# EAGLE design lia_2-0 (EAGLE 6.5.0)

## Sheet 1 of 3
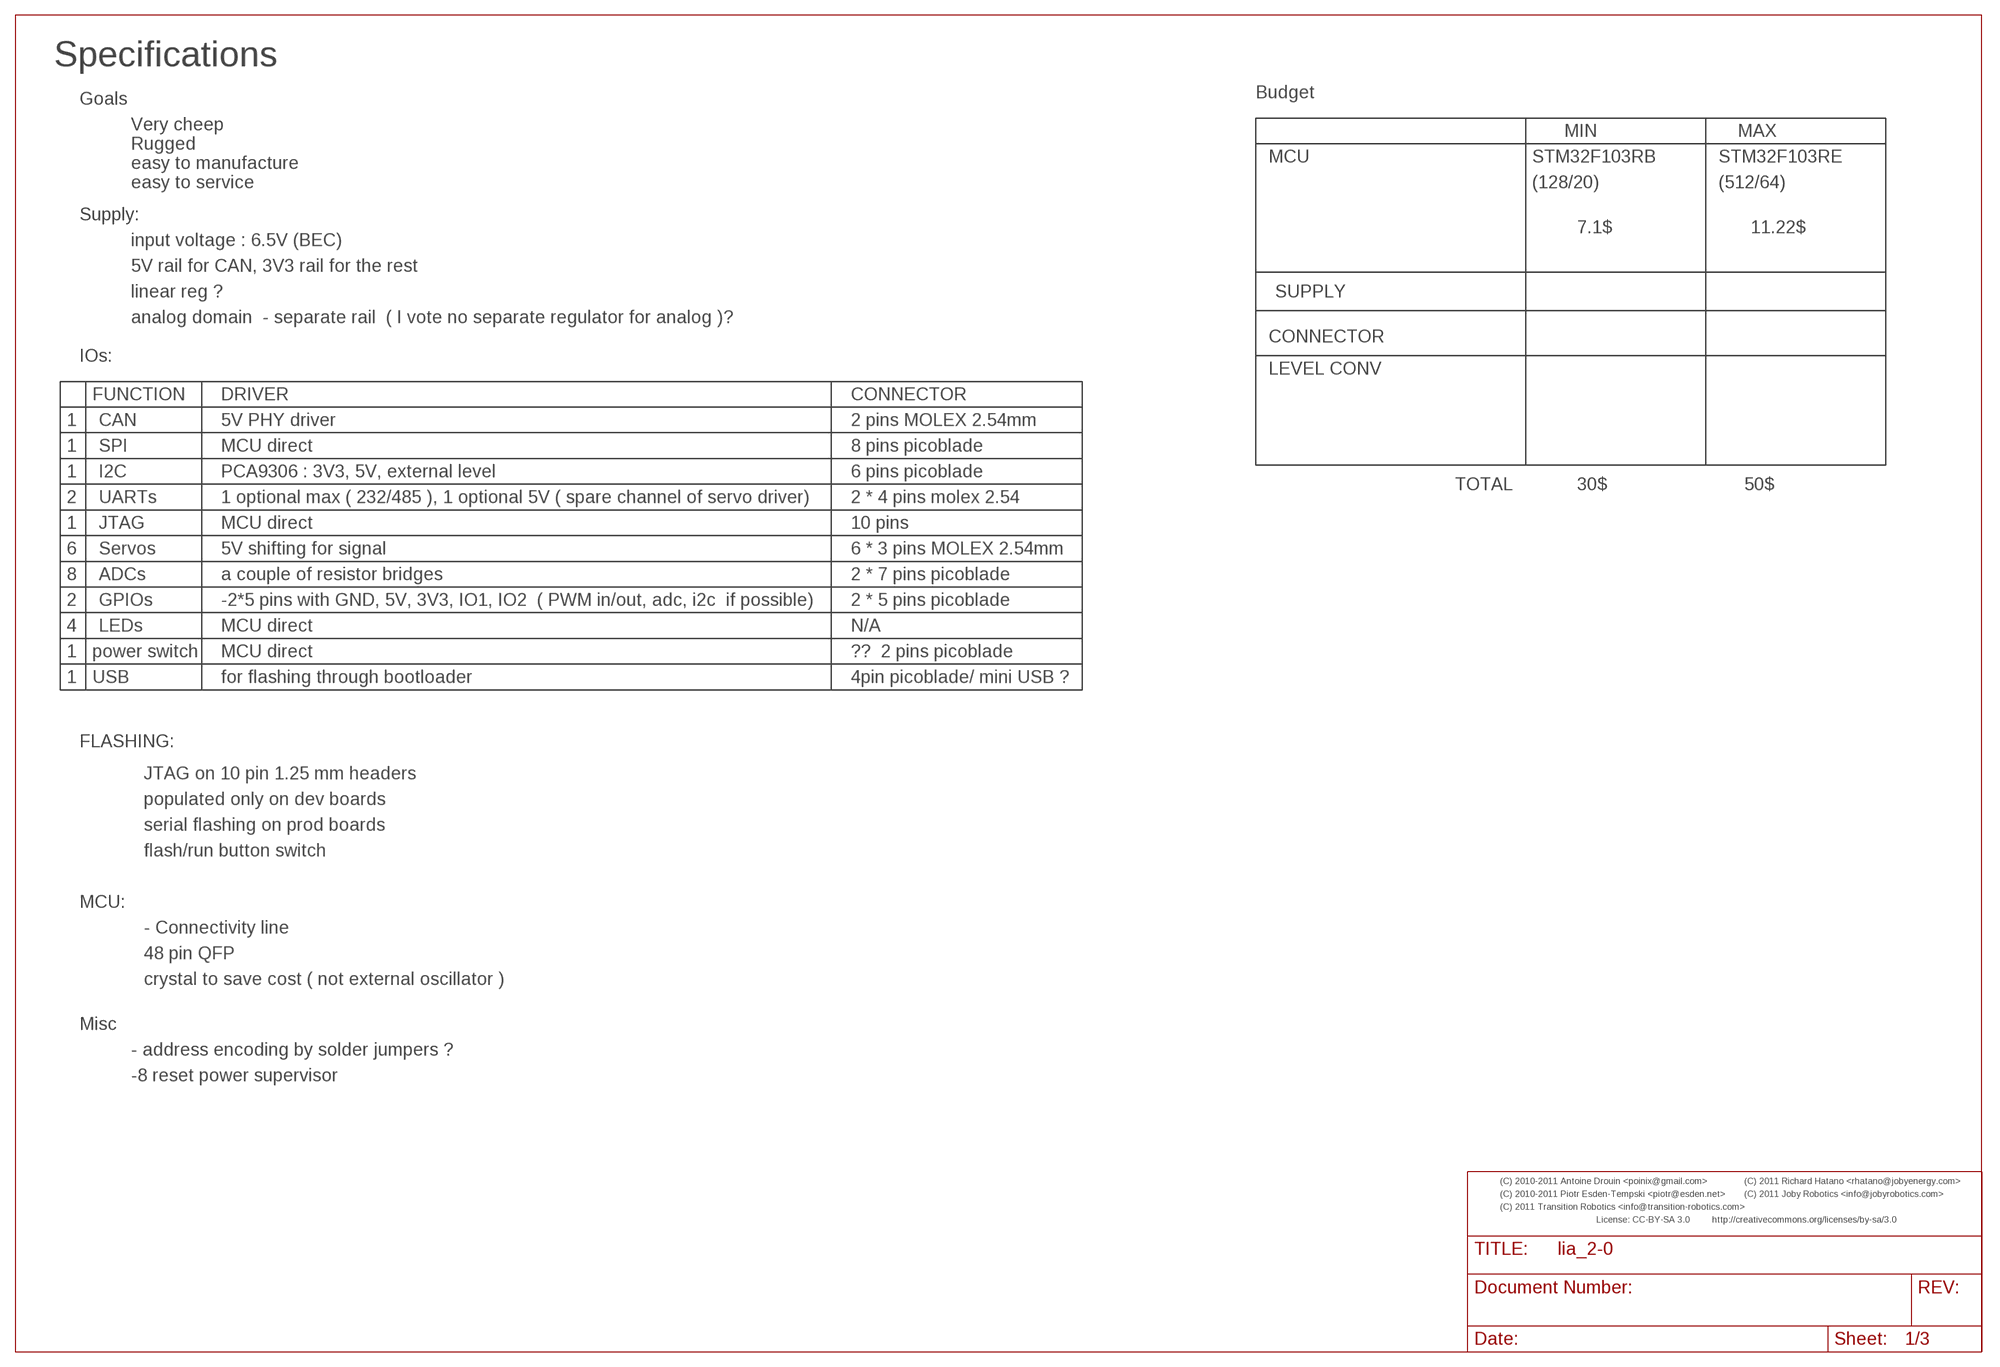
[diagram p0: schematic, sheet 1]

### Notes on the sheet
- Specifications
- Budget
- Goals
- Very cheep
- MIN | MAX
- Rugged
- MCU | STM32F103RB | STM32F103RE
- easy to manufacture
- easy to service | (128/20) | (512/64)
- Supply:
- 7.1$ | 11.22$
- input voltage : 6.5V (BEC)
- 5V rail for CAN, 3V3 rail for the rest
- linear reg ? | SUPPLY
- analog domain  - separate rail  ( I vote no separate regulator for analog )?
- CONNECTOR
- IOs:
- LEVEL CONV
- FUNCTION | DRIVER | CONNECTOR
- 1 | CAN | 5V PHY driver | 2 pins MOLEX 2.54mm
- 1 | SPI | MCU direct | 8 pins picoblade
- 1 | I2C | PCA9306 : 3V3, 5V, external level | 6 pins picoblade
- TOTAL | 30$ | 50$
- 2 | UARTs | 1 optional max ( 232/485 ), 1 optional 5V ( spare channel of servo driver) | 2 * 4 pins molex 2.54
- 1 | JTAG | MCU direct | 10 pins
- 6 | Servos | 5V shifting for signal | 6 * 3 pins MOLEX 2.54mm
- 8 | ADCs | a couple of resistor bridges | 2 * 7 pins picoblade
- 2 | GPIOs | -2*5 pins with GND, 5V, 3V3, IO1, IO2  ( PWM in/out, adc, i2c  if possible) | 2 * 5 pins picoblade
- 4 | LEDs | MCU direct | N/A
- 1 | power switch | MCU direct | ??  2 pins picoblade
- 1 | USB | for flashing through bootloader | 4pin picoblade/ mini USB ?
- FLASHING:
- JTAG on 10 pin 1.25 mm headers
- populated only on dev boards
- serial flashing on prod boards
- flash/run button switch
- MCU:
- - Connectivity line
- 48 pin QFP
- crystal to save cost ( not external oscillator )
- Misc
- - address encoding by solder jumpers ?
- -8 reset power supervisor
- (C) 2010-2011 Antoine Drouin <poinix@gmail.com> | (C) 2011 Richard Hatano <rhatano@jobyenergy.com>
- (C) 2010-2011 Piotr Esden-Tempski <piotr@esden.net> | (C) 2011 Joby Robotics <info@jobyrobotics.com>
- (C) 2011 Transition Robotics <info@transition-robotics.com>
- License: CC-BY-SA 3.0 | http://creativecommons.org/licenses/by-sa/3.0

## Sheet 2 of 3
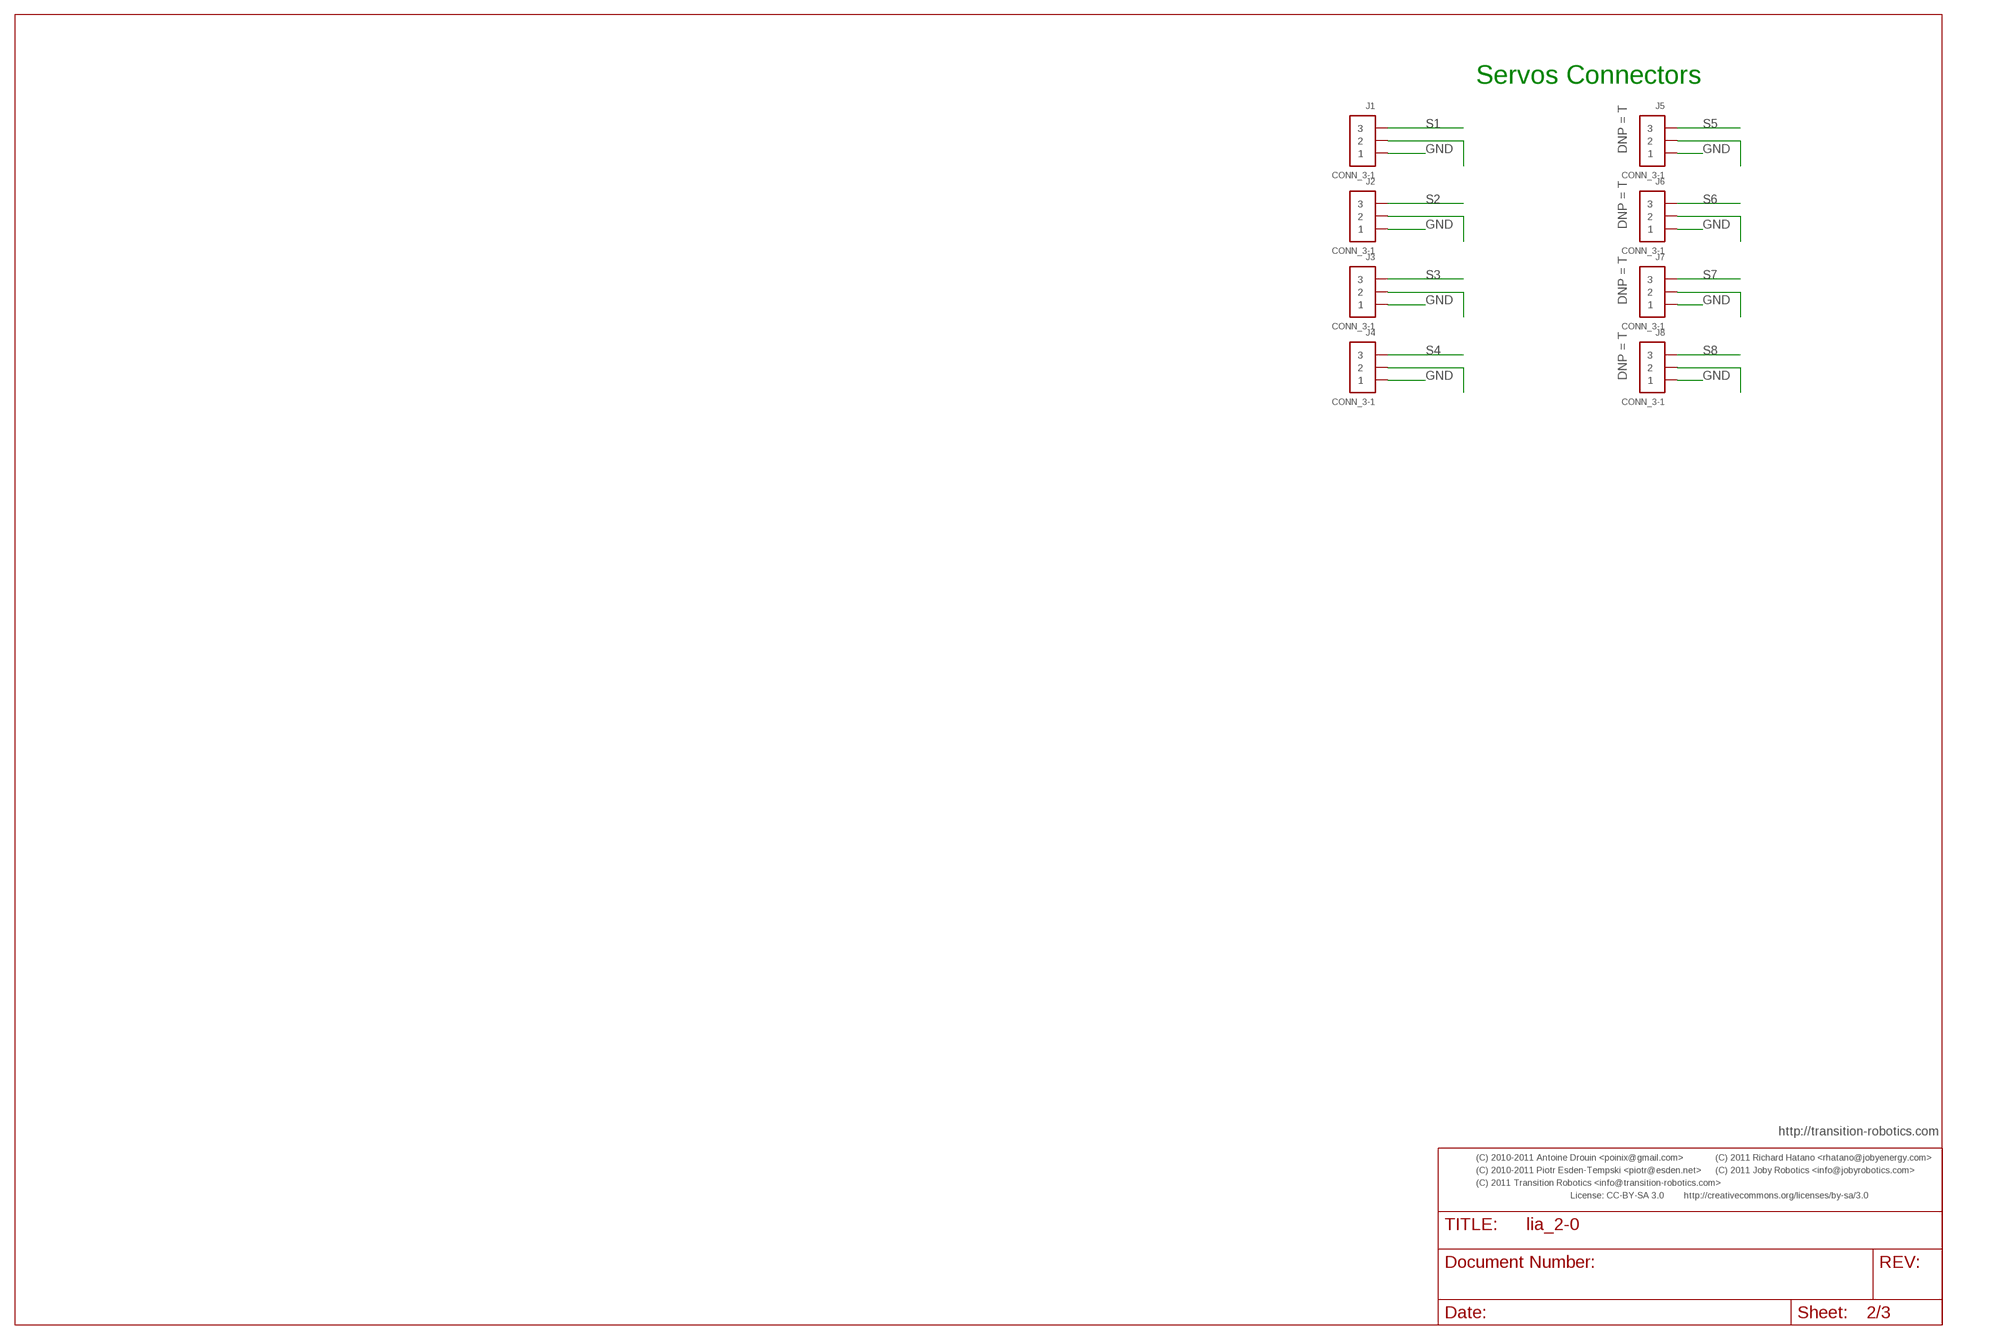
[diagram p1: schematic, sheet 2]

### Parts
J1  CONN_3-1  [SIP1X3_100]
J2  CONN_3-1  [SIP1X3_100]
J3  CONN_3-1  [SIP1X3_100]
J4  CONN_3-1  [SIP1X3_100]
J5  CONN_3-1  [SIP1X3_100]
J6  CONN_3-1  [SIP1X3_100]
J7  CONN_3-1  [SIP1X3_100]
J8  CONN_3-1  [SIP1X3_100]

### Nets
GND: J1.1 J2.1 J3.1 J4.1 J5.1 J6.1 J7.1 J8.1 ; also sheet 3
N$2: J5.2
N$3: J6.2
N$16: J7.2
N$17: J8.2
N$18: J4.2
N$19: J3.2
N$20: J2.2
N$21: J1.2
S1: J1.3
S2: J2.3
S3: J3.3
S4: J4.3
S5: J5.3
S6: J6.3
S7: J7.3
S8: J8.3

### Notes on the sheet
- Servos Connectors
- http://transition-robotics.com
- (C) 2010-2011 Antoine Drouin <poinix@gmail.com> | (C) 2011 Richard Hatano <rhatano@jobyenergy.com>
- (C) 2010-2011 Piotr Esden-Tempski <piotr@esden.net> | (C) 2011 Joby Robotics <info@jobyrobotics.com>
- (C) 2011 Transition Robotics <info@transition-robotics.com>
- License: CC-BY-SA 3.0 | http://creativecommons.org/licenses/by-sa/3.0

## Sheet 3 of 3
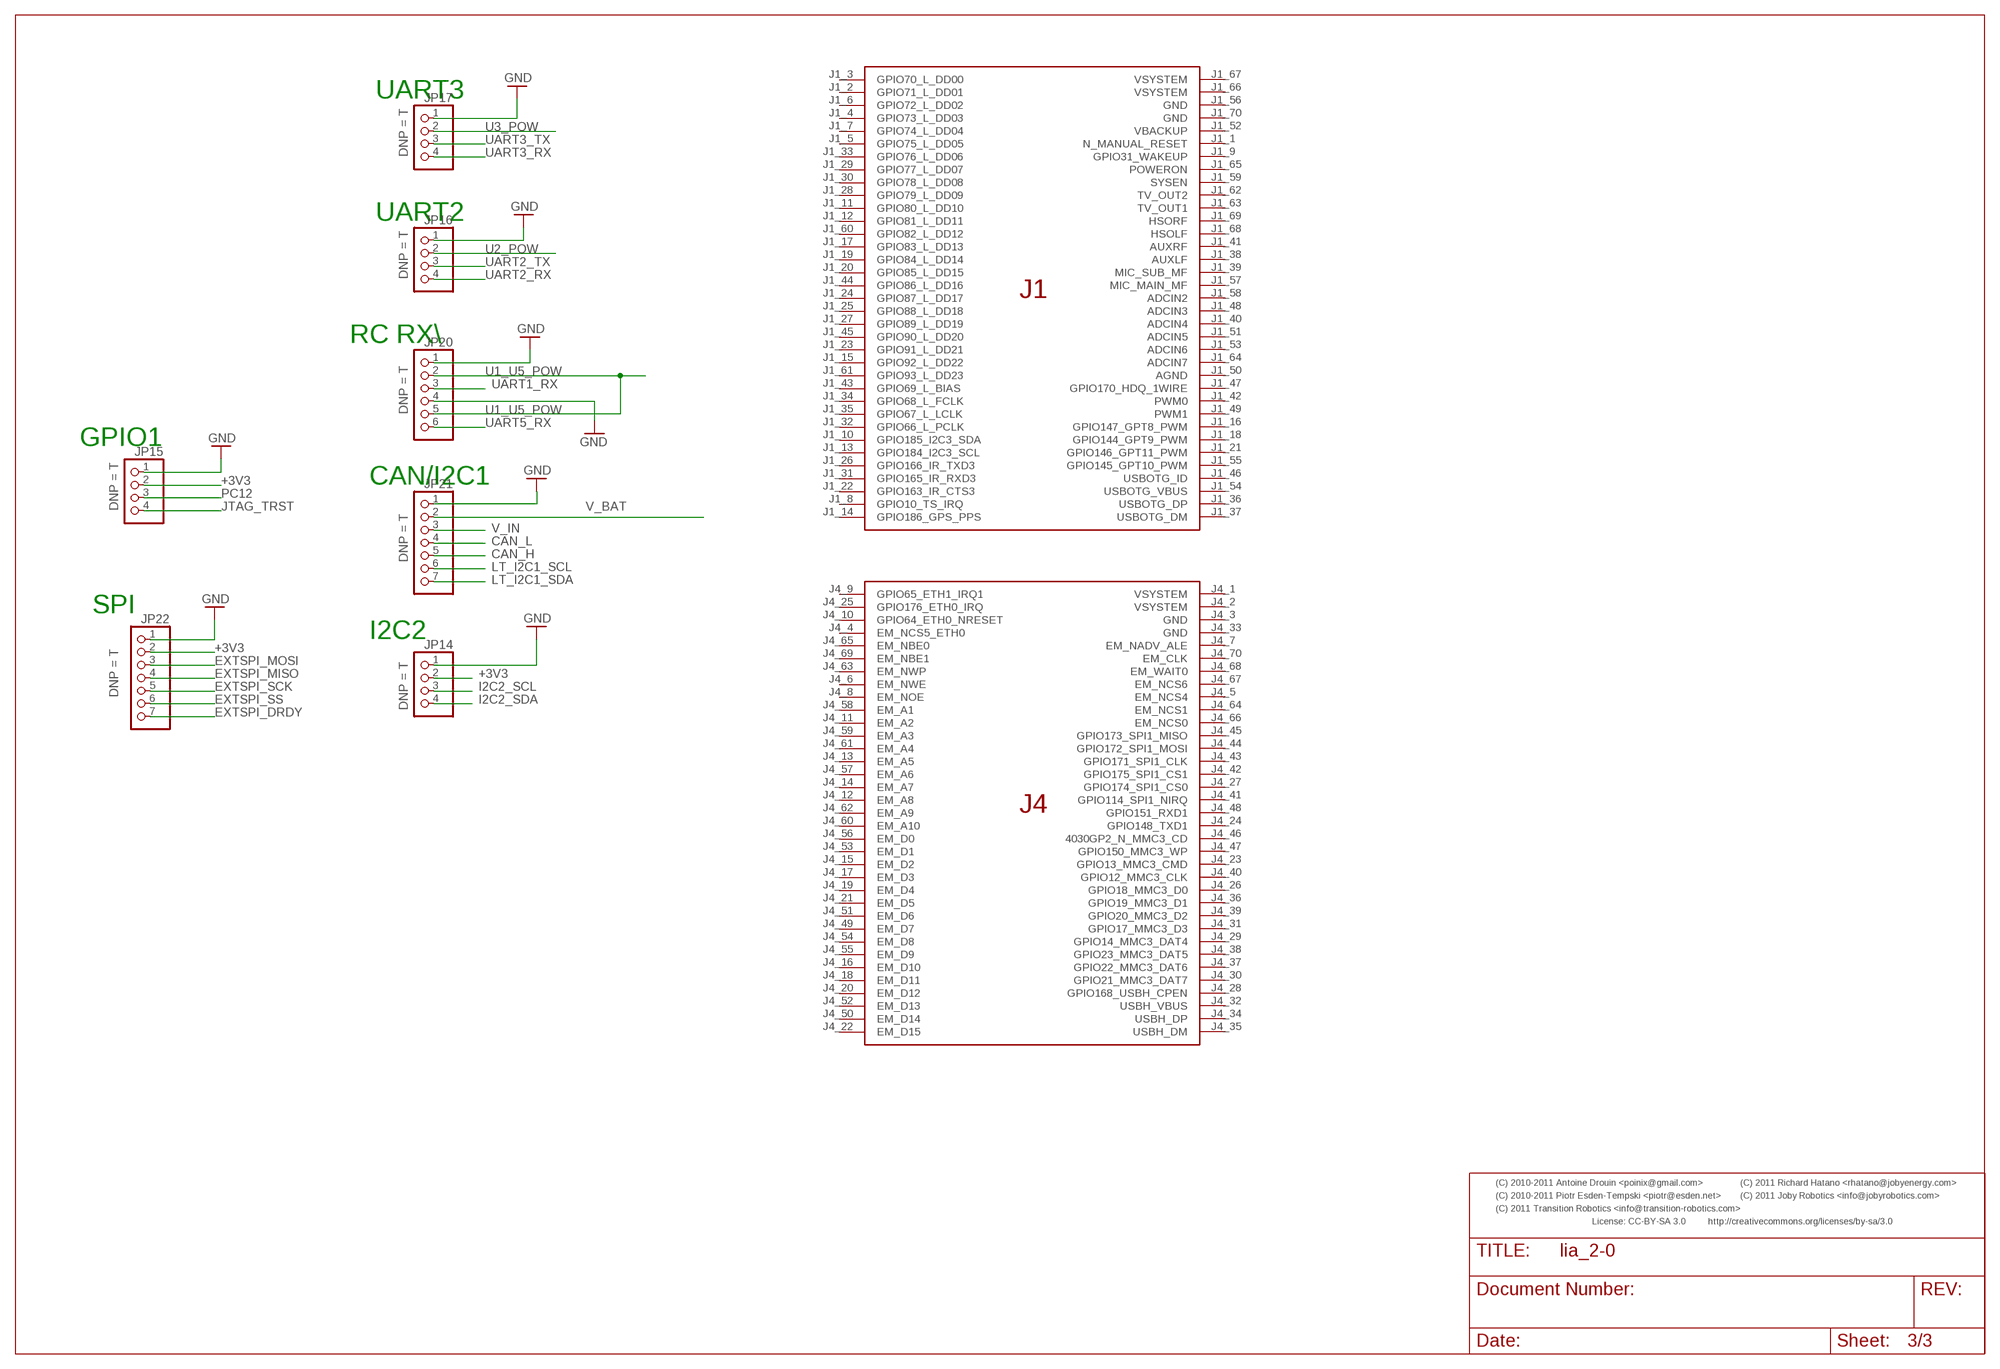
[diagram p2: schematic, sheet 3]

### Parts
JP14  PINHD-1X4  [1X04]
JP15  PINHD-1X4  [1X04]
JP16  PINHD-1X4  [1X04]
JP17  PINHD-1X4  [1X04]
JP20  PINHD-1X6  [1X06]
JP21  PINHD-1X7  [1X07]
JP22  PINHD-1X7  [1X07]
U$2  OVERO  [OVERO]

### Nets
+3V3: JP14.2 JP15.2 JP22.2
CAN_H: JP21.5
CAN_L: JP21.4
EXTSPI_DRDY: JP22.7
EXTSPI_MISO: JP22.4
EXTSPI_MOSI: JP22.3
EXTSPI_SCK: JP22.5
EXTSPI_SS: JP22.6
GND: JP14.1 JP15.1 JP16.1 JP17.1 JP20.1 JP20.4 JP21.1 JP22.1 ; also sheet 2
I2C2_SCL: JP14.3
I2C2_SDA: JP14.4
JTAG_TRST: JP15.4
LT_I2C1_SCL: JP21.6
LT_I2C1_SDA: JP21.7
PC12: JP15.3
U1_U5_POW: JP20.2 JP20.5
U2_POW: JP16.2
U3_POW: JP17.2
UART1_RX: JP20.3
UART2_RX: JP16.4
UART2_TX: JP16.3
UART3_RX: JP17.4
UART3_TX: JP17.3
UART5_RX: JP20.6
V_BAT: JP21.2
V_IN: JP21.3
Unconnected: U$2.J1_1(N_MANUAL_RESET) U$2.J1_2(GPIO71_L_DD01) U$2.J1_3(GPIO70_L_DD00) U$2.J1_4(GPIO73_L_DD03) U$2.J1_5(GPIO75_L_DD05) U$2.J1_6(GPIO72_L_DD02) U$2.J1_7(GPIO74_L_DD04) U$2.J1_8(GPIO10_TS_IRQ) U$2.J1_9(GPIO31_WAKEUP) U$2.J1_10(GPIO185_I2C3_SDA) U$2.J1_11(GPIO80_L_DD10) U$2.J1_12(GPIO81_L_DD11) U$2.J1_13(GPIO184_I2C3_SCL) U$2.J1_14(GPIO186_GPS_PPS) U$2.J1_15(GPIO92_L_DD22) U$2.J1_16(GPIO147_GPT8_PWM) U$2.J1_17(GPIO83_L_DD13) U$2.J1_18(GPIO144_GPT9_PWM) U$2.J1_19(GPIO84_L_DD14) U$2.J1_20(GPIO85_L_DD15) U$2.J1_21(GPIO146_GPT11_PWM) U$2.J1_22(GPIO163_IR_CTS3) U$2.J1_23(GPIO91_L_DD21) U$2.J1_24(GPIO87_L_DD17) U$2.J1_25(GPIO88_L_DD18) U$2.J1_26(GPIO166_IR_TXD3) U$2.J1_27(GPIO89_L_DD19) U$2.J1_28(GPIO79_L_DD09) U$2.J1_29(GPIO77_L_DD07) U$2.J1_30(GPIO78_L_DD08) U$2.J1_31(GPIO165_IR_RXD3) U$2.J1_32(GPIO66_L_PCLK) U$2.J1_33(GPIO76_L_DD06) U$2.J1_34(GPIO68_L_FCLK) U$2.J1_35(GPIO67_L_LCLK) U$2.J1_36(USBOTG_DP) U$2.J1_37(USBOTG_DM) U$2.J1_38(AUXLF) U$2.J1_39(MIC_SUB_MF) U$2.J1_40(ADCIN4) U$2.J1_41(AUXRF) U$2.J1_42(PWM0) U$2.J1_43(GPIO69_L_BIAS) U$2.J1_44(GPIO86_L_DD16) U$2.J1_45(GPIO90_L_DD20) U$2.J1_46(USBOTG_ID) U$2.J1_47(GPIO170_HDQ_1WIRE) U$2.J1_48(ADCIN3) U$2.J1_49(PWM1) U$2.J1_50(AGND) U$2.J1_51(ADCIN5) U$2.J1_52(VBACKUP) U$2.J1_53(ADCIN6) U$2.J1_54(USBOTG_VBUS) U$2.J1_55(GPIO145_GPT10_PWM) U$2.J1_56(GND) U$2.J1_57(MIC_MAIN_MF) U$2.J1_58(ADCIN2) U$2.J1_59(SYSEN) U$2.J1_60(GPIO82_L_DD12) U$2.J1_61(GPIO93_L_DD23) U$2.J1_62(TV_OUT2) U$2.J1_63(TV_OUT1) U$2.J1_64(ADCIN7) U$2.J1_65(POWERON) U$2.J1_66(VSYSTEM) U$2.J1_67(VSYSTEM) U$2.J1_68(HSOLF) U$2.J1_69(HSORF) U$2.J1_70(GND) U$2.J4_1(VSYSTEM) U$2.J4_2(VSYSTEM) U$2.J4_3(GND) U$2.J4_4(EM_NCS5_ETH0) U$2.J4_5(EM_NCS4) U$2.J4_6(EM_NWE) U$2.J4_7(EM_NADV_ALE) U$2.J4_8(EM_NOE) U$2.J4_9(GPIO65_ETH1_IRQ1) U$2.J4_10(GPIO64_ETH0_NRESET) U$2.J4_11(EM_A2) U$2.J4_12(EM_A8) U$2.J4_13(EM_A5) U$2.J4_14(EM_A7) U$2.J4_15(EM_D2) U$2.J4_16(EM_D10) U$2.J4_17(EM_D3) U$2.J4_18(EM_D11) U$2.J4_19(EM_D4) U$2.J4_20(EM_D12) U$2.J4_21(EM_D5) U$2.J4_22(EM_D15) U$2.J4_23(GPIO13_MMC3_CMD) U$2.J4_24(GPIO148_TXD1) U$2.J4_25(GPIO176_ETH0_IRQ) U$2.J4_26(GPIO18_MMC3_D0) U$2.J4_27(GPIO174_SPI1_CS0) U$2.J4_28(GPIO168_USBH_CPEN) U$2.J4_29(GPIO14_MMC3_DAT4) U$2.J4_30(GPIO21_MMC3_DAT7) U$2.J4_31(GPIO17_MMC3_D3) U$2.J4_32(USBH_VBUS) U$2.J4_33(GND) U$2.J4_34(USBH_DP) U$2.J4_35(USBH_DM) U$2.J4_36(GPIO19_MMC3_D1) U$2.J4_37(GPIO22_MMC3_DAT6) U$2.J4_38(GPIO23_MMC3_DAT5) U$2.J4_39(GPIO20_MMC3_D2) U$2.J4_40(GPIO12_MMC3_CLK) U$2.J4_41(GPIO114_SPI1_NIRQ) U$2.J4_42(GPIO175_SPI1_CS1) U$2.J4_43(GPIO171_SPI1_CLK) U$2.J4_44(GPIO172_SPI1_MOSI) U$2.J4_45(GPIO173_SPI1_MISO) U$2.J4_46(4030GP2_N_MMC3_CD) U$2.J4_47(GPIO150_MMC3_WP) U$2.J4_48(GPIO151_RXD1) U$2.J4_49(EM_D7) U$2.J4_50(EM_D14) U$2.J4_51(EM_D6) U$2.J4_52(EM_D13) U$2.J4_53(EM_D1) U$2.J4_54(EM_D8) U$2.J4_55(EM_D9) U$2.J4_56(EM_D0) U$2.J4_57(EM_A6) U$2.J4_58(EM_A1) U$2.J4_59(EM_A3) U$2.J4_60(EM_A10) U$2.J4_61(EM_A4) U$2.J4_62(EM_A9) U$2.J4_63(EM_NWP) U$2.J4_64(EM_NCS1) U$2.J4_65(EM_NBE0) U$2.J4_66(EM_NCS0) U$2.J4_67(EM_NCS6) U$2.J4_68(EM_WAIT0) U$2.J4_69(EM_NBE1) U$2.J4_70(EM_CLK)

### Notes on the sheet
- UART3
- UART2
- RC RX\
- GPIO1
- CAN/I2C1
- SPI
- I2C2
- (C) 2010-2011 Antoine Drouin <poinix@gmail.com> | (C) 2011 Richard Hatano <rhatano@jobyenergy.com>
- (C) 2010-2011 Piotr Esden-Tempski <piotr@esden.net> | (C) 2011 Joby Robotics <info@jobyrobotics.com>
- (C) 2011 Transition Robotics <info@transition-robotics.com>
- License: CC-BY-SA 3.0 | http://creativecommons.org/licenses/by-sa/3.0

## Library data of the parts
J1-J4 = pel_misc:CONN_3-1; PARTNO: conn-th-0.1in-3-2-ra
J5-J8 = pel_misc:CONN_3-1; DNP: T; PARTNO: conn-th-0.1in-3-2-ra
JP14-JP17 = pinhead:PINHD-1X4: PIN HEADER; DNP: T; PARTNO: conn-th-0.1in-4-1
JP20 = pinhead:PINHD-1X6: PIN HEADER; DNP: T; PARTNO: conn-th-0.1in-6-1
JP21 JP22 = pinhead:PINHD-1X7: PIN HEADER; DNP: T; PARTNO: conn-th-0.1in-7-1
U$2 = overo:OVERO

## Net classes
0 default: width 0.152 mm, drill 0.305 mm, clearance 0.152 mm
4 xxwide: width 0.203 mm
5 USB: width 0.14 mm

## Board
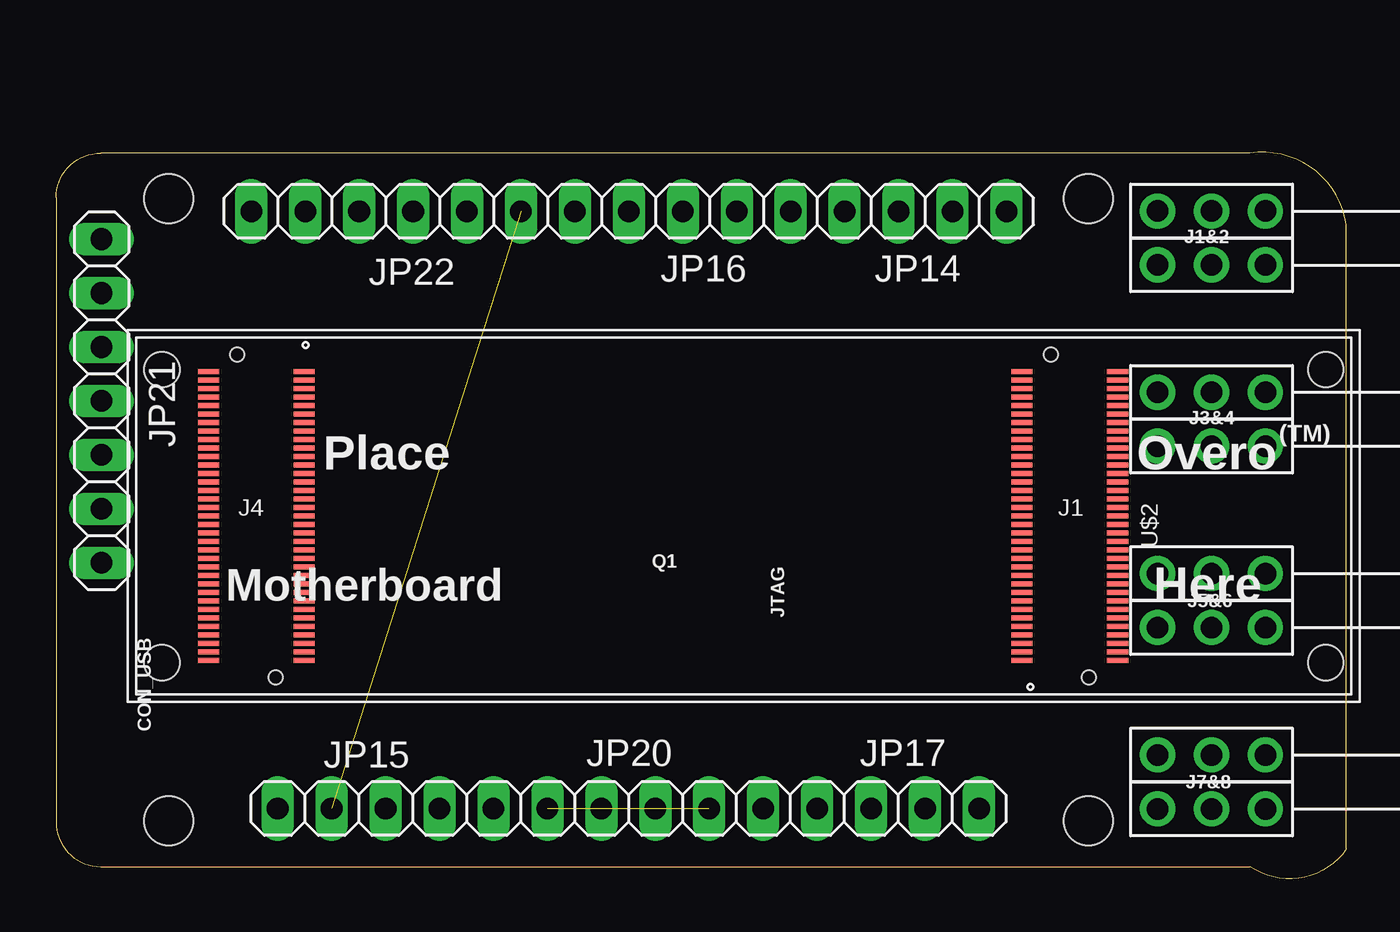
[diagram p3: board, top side]
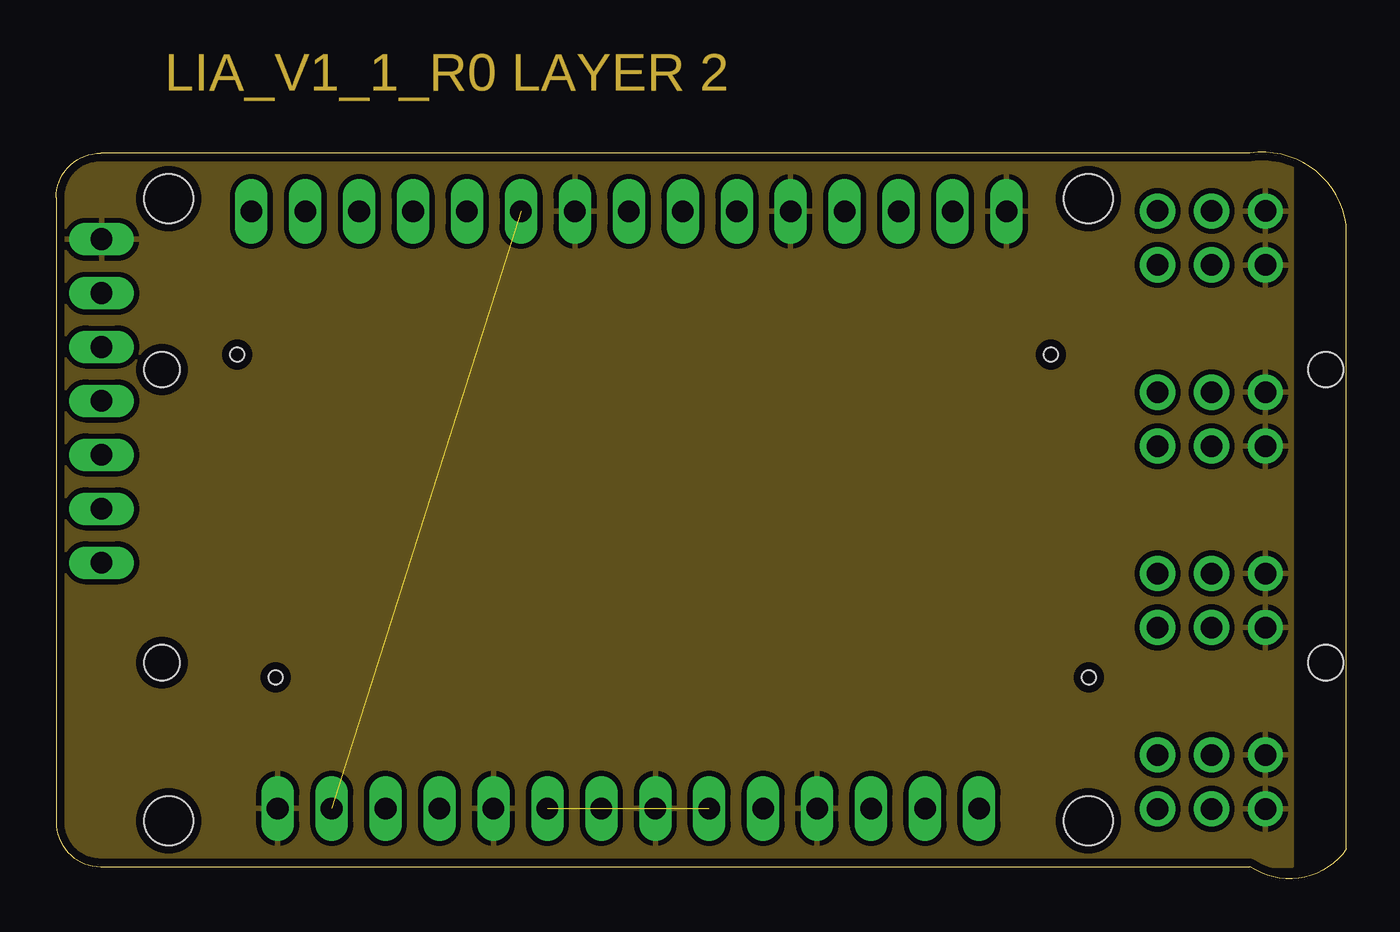
[diagram p4: board, inner layer Route2]
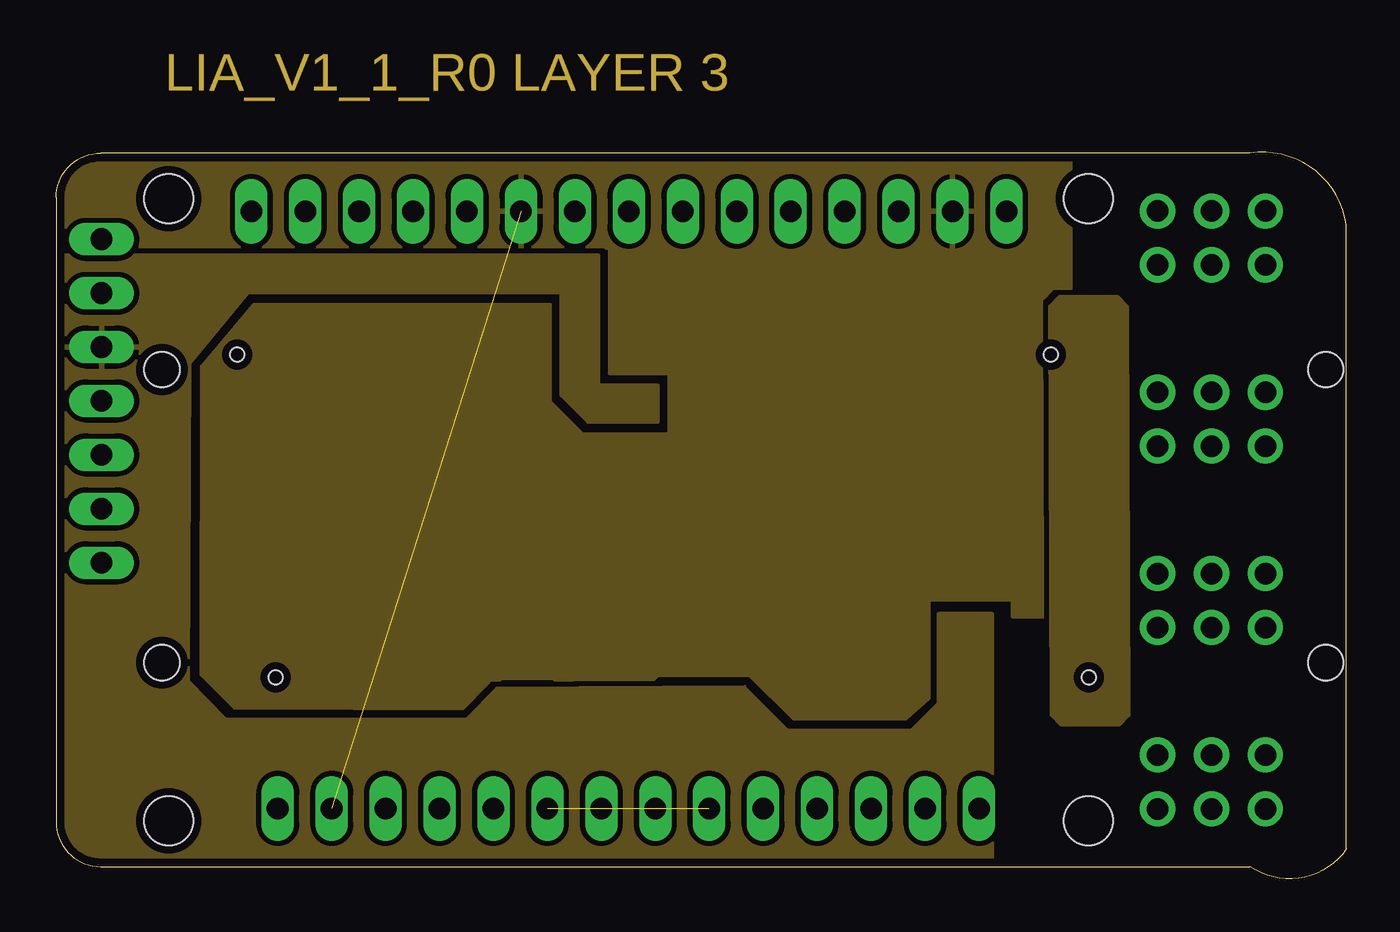
[diagram p5: board, inner layer Route15]
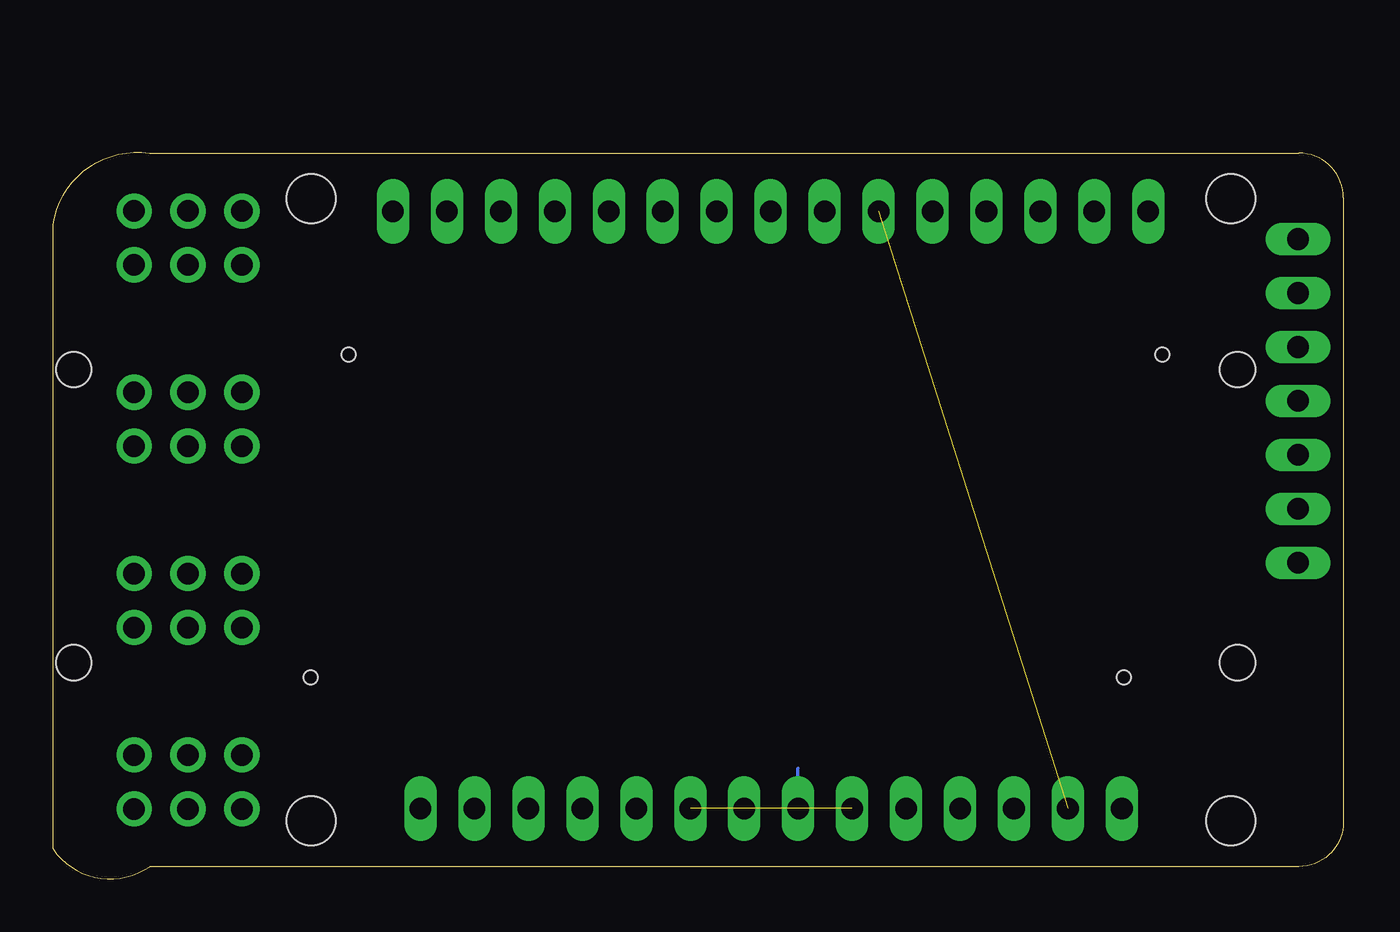
[diagram p6: board, bottom side, seen from below]

Size 60.76 x 34.22 mm. Coordinates in mm from the lower left corner, seen from the top.
Outline: 2.1,0.58 56.22,0.58 arc90 60.76,1.41 60.76,30.81 arc90 56.22,34.18 2.1,34.18 arc90 0,32.08 0,2.68 arc90 2.1,0.58
Copper layers (1*16): Top 0.0356mm / dielectric 1.5011mm / Bottom 0.0356mm
Design rules "oshpark-2layer": minimum track width 6mil, minimum drill 13mil, track to track 6mil, track to pad 6mil, pad to pad 6mil, via to via 6mil, smd to smd 6mil, copper to edge 15mil, drill to drill 6mil, minimum pad ring 7mil, minimum via ring 7mil, stop-mask expansion 4mil, vias tented up to drill 0mil, thermal gap 10mil
Holes 2.3 mm at 5.3,2.73 5.3,32.03 48.6,32.03 48.6,2.73
tKeepout: area 3.3,0.7 to 7.3,4.7; area 46.6,0.7 to 50.6,4.7; area 3.3,30 to 7.3,34; area 46.6,30 to 50.6,34
tRestrict: area 44.8,15.7 to 44.9,16; area 42.7,15.7 to 42.8,16; area 43.5,20.8 to 43.8,20.9; area 34.5,25.8 to 34.6,26.1; area 29.6,17.3 to 29.7,17.6; area 28.1,17 to 28.2,17.2; area 10.6,16.9 to 10.7,17.1; area 16.4,21.6 to 16.7,21.7; area 43.6,13.6 to 43.9,13.6; area 39,18.4 to 39.3,18.5; area 26,18.2 to 26.1,18.3; area 9.5,14.8 to 9.6,15; area 18.9,12.6 to 19,12.8; area 23.6,18.7 to 24,18.8; area 13.7,21.1 to 13.8,21.3; area 11.8,20.8 to 12.1,20.8; area 31.3,10.1 to 31.4,10.3; area 30.1,14.7 to 30.3,14.8; area 11.7,24.8 to 11.9,24.9; area 27.4,5 to 27.5,5.4
bRestrict: area 5.5,27.5 to 5.7,27.6; area 11.1,24.1 to 11.3,24.2; area 6.7,17.4 to 6.8,17.6; area 8,17.4 to 8.1,17.6; area 8.3,11 to 8.4,11.2; area 14.9,13.4 to 15,13.6; area 30.7,20.6 to 30.8,20.8; area 33.7,25.3 to 33.9,25.4; area 34.5,10.5 to 34.6,10.6; area 31.6,19 to 31.7,19.1; area 31.5,9.9 to 31.6,10.1; area 28.9,20.1 to 29,20.2

### Footprints (pad centres in the part's own frame; a part is rotated, then mirrored left to right if it is on the bottom)
SIP1X3_100 = drill 1.016 pad 1.651: 1 2.54,0; 2 0,0; 3 -2.54,0
1X04 = drill 1.016 long: 1 -3.81,0; 2 -1.27,0; 3 1.27,0; 4 3.81,0
1X06 = drill 1.016 long: 1 -6.35,0; 2 -3.81,0; 3 -1.27,0; 4 1.27,0; 5 3.81,0; 6 6.35,0
1X07 = drill 1.016 long: 1 -7.62,0; 2 -5.08,0; 3 -2.54,0; 4 0,0; 5 2.54,0; 6 5.08,0; 7 7.62,0
OVERO = smd 1 x 0.23: J1_1 13.1,-6.8; J1_2 13.1,-6.4; J1_3 13.1,-6; J1_4 13.1,-5.6; J1_5 13.1,-5.2; J1_6 13.1,-4.8; J1_7 13.1,-4.4; J1_8 13.1,-4; J1_9 13.1,-3.6; J1_10 13.1,-3.2; J1_11 13.1,-2.8; J1_12 13.1,-2.4; J1_13 13.1,-2; J1_14 13.1,-1.6; J1_15 13.1,-1.2; J1_16 13.1,-0.8; J1_17 13.1,-0.4; J1_18 13.1,0; J1_19 13.1,0.4; J1_20 13.1,0.8; J1_21 13.1,1.2; J1_22 13.1,1.6; J1_23 13.1,2; J1_24 13.1,2.4; J1_25 13.1,2.8; J1_26 13.1,3.2; J1_27 13.1,3.6; J1_28 13.1,4; J1_29 13.1,4.4; J1_30 13.1,4.8; J1_31 13.1,5.2; J1_32 13.1,5.6; J1_33 13.1,6; J1_34 13.1,6.4; J1_35 13.1,6.8; J1_36 17.6,6.8; J1_37 17.6,6.4; J1_38 17.6,6; J1_39 17.6,5.6; J1_40 17.6,5.2; J1_41 17.6,4.8; J1_42 17.6,4.4; J1_43 17.6,4; J1_44 17.6,3.6; J1_45 17.6,3.2; J1_46 17.6,2.8; J1_47 17.6,2.4; J1_48 17.6,2; J1_49 17.6,1.6; J1_50 17.6,1.2; J1_51 17.6,0.8; J1_52 17.6,0.4; J1_53 17.6,0; J1_54 17.6,-0.4; J1_55 17.6,-0.8; J1_56 17.6,-1.2; J1_57 17.6,-1.6; J1_58 17.6,-2; J1_59 17.6,-2.4; J1_60 17.6,-2.8; J1_61 17.6,-3.2; J1_62 17.6,-3.6; J1_63 17.6,-4; J1_64 17.6,-4.4; J1_65 17.6,-4.8; J1_66 17.6,-5.2; J1_67 17.6,-5.6; J1_68 17.6,-6; J1_69 17.6,-6.4; J1_70 17.6,-6.8; J4_1 -20.7,6.8; J4_2 -20.7,6.4; J4_3 -20.7,6; J4_4 -20.7,5.6; J4_5 -20.7,5.2; J4_6 -20.7,4.8; J4_7 -20.7,4.4; J4_8 -20.7,4; J4_9 -20.7,3.6; J4_10 -20.7,3.2; J4_11 -20.7,2.8; J4_12 -20.7,2.4; J4_13 -20.7,2; J4_14 -20.7,1.6; J4_15 -20.7,1.2; J4_16 -20.7,0.8; J4_17 -20.7,0.4; J4_18 -20.7,0; J4_19 -20.7,-0.4; J4_20 -20.7,-0.8; J4_21 -20.7,-1.2; J4_22 -20.7,-1.6; J4_23 -20.7,-2; J4_24 -20.7,-2.4; J4_25 -20.7,-2.8; J4_26 -20.7,-3.2; J4_27 -20.7,-3.6; J4_28 -20.7,-4; J4_29 -20.7,-4.4; J4_30 -20.7,-4.8; J4_31 -20.7,-5.2; J4_32 -20.7,-5.6; J4_33 -20.7,-6; J4_34 -20.7,-6.4; J4_35 -20.7,-6.8; J4_36 -25.2,-6.8; J4_37 -25.2,-6.4; J4_38 -25.2,-6; J4_39 -25.2,-5.6; J4_40 -25.2,-5.2; J4_41 -25.2,-4.8; J4_42 -25.2,-4.4; J4_43 -25.2,-4; J4_44 -25.2,-3.6; J4_45 -25.2,-3.2; J4_46 -25.2,-2.8; J4_47 -25.2,-2.4; J4_48 -25.2,-2; J4_49 -25.2,-1.6; J4_50 -25.2,-1.2; J4_51 -25.2,-0.8; J4_52 -25.2,-0.4; J4_53 -25.2,0; J4_54 -25.2,0.4; J4_55 -25.2,0.8; J4_56 -25.2,1.2; J4_57 -25.2,1.6; J4_58 -25.2,2; J4_59 -25.2,2.4; J4_60 -25.2,2.8; J4_61 -25.2,3.2; J4_62 -25.2,3.6; J4_63 -25.2,4; J4_64 -25.2,4.4; J4_65 -25.2,4.8; J4_66 -25.2,5.2; J4_67 -25.2,5.6; J4_68 -25.2,6; J4_69 -25.2,6.4; J4_70 -25.2,6.8 | hole 1.65: 27.4,6.9; 27.4,-6.9; -27.4,6.9; -27.4,-6.9 | hole 0.65: -23.85,7.6; -22.05,-7.6; 14.45,7.6; 16.25,-7.6

### Placement (x,y rotation side)
J1  54.41,31.45 0 top
J2  54.41,28.91 0 top
J3  54.41,22.91 0 top
J4  54.41,20.37 0 top
J5  54.41,14.37 0 top
J6  54.41,11.83 0 top
J7  54.41,5.83 0 top
J8  54.41,3.29 0 top
JP14  40.94,31.44 180 top
JP15  14.25,3.32 0 top
JP16  30.78,31.44 180 top
JP17  39.65,3.32 0 top
JP20  26.95,3.32 0 top
JP21  2.15,22.51 270 top
JP22  16.81,31.44 180 top
U$2  32.38,17.09 0 top

### Tracks (layer width: path | path; a pad name or v marks a point on that pad's centre or on a via)
+3V3  (1 unrouted)
  pour Route15 (isolate 0.254, rank 2): 19.58,7.98 8.41,8.03 6.83,9.6 6.85,24.16 9.32,27.08 23.27,27.08 23.27,22.51 24.79,20.98 28.85,20.98 28.85,23.78 26.06,23.78 26.06,29.68 0.3,29.68 0.3,34.18 47.8,34.18 47.8,28.96 47.72,12.32 45.03,12.32 45.03,13.11 41.09,13.08 41.09,8.48 40.02,7.52 34.72,7.52 32.66,9.55 28.35,9.55 26.57,7.77 25.04,7.77 23.39,9.42 20.98,9.42
GND
  pour Route2 (isolate 0.254): 0,0.58 0,34.18 58.22,34.18 58.22,0.58
S4
  Top 0.152: 51.78,20.47 J4.3
SERVO_BUS
  pour Route15 (isolate 0.254): 47.24,27.43 49.99,27.43 50.44,26.98 50.52,7.7 50.06,7.24 47.32,7.24 46.86,7.7 46.79,26.98
U1_U5_POW  (1 unrouted)
UART1_RX
  Bottom 0.152: JP20.3 25.68,5.23
V_IN
  pour Route15 (isolate 0.254): 44.09,12.52 44.09,0.58 0,0.58 0,29.39 25.55,29.39 25.55,23.27 28.35,23.27 28.35,21.49 25.04,21.49 23.77,22.76 23.77,27.59 9.04,27.59 6.3,24.23 6.22,9.35 8,7.54 19.33,7.54 20.78,8.99 20.73,8.99 32.46,9.07 32.41,9.04 34.44,7.01 40.28,7.01 41.55,8.28 41.55,12.52

### Text on the board
Route2: LIA_V1_1_R0 LAYER 2
Route15: LIA_V1_1_R0 LAYER 3
tNames: J1&2 | J3&4 | Q1 | JTAG | J5&6 | CON_USB | J7&8
tStop: LIA_V1_0_R0 SOLDER MASK TOP
bStop: LIA_V1_0_R0 SOLDER MASK BOTTOM
tCream: LISA_M_V1_1_R0 SOLDER PASTE TOP
bCream: LISA_M_V1_1_R0 SOLDER PASTE BOTTOM
Reference: (C) 2010-2011 Antoine Drouin <poinix@gmail.com> | Licensed under: | (C) 2010-2012 Piotr Esden-Tempski <piotr@esden.net> | CC-BY-SA 3.0 | (C) 2011 Richard Hatano <rhatano@jobyenergy.com> | (C) 2011-2012 Transition Robotics <info@transition-robotics.com> | http://creativecommons.org/licenses/by-sa/3.0/